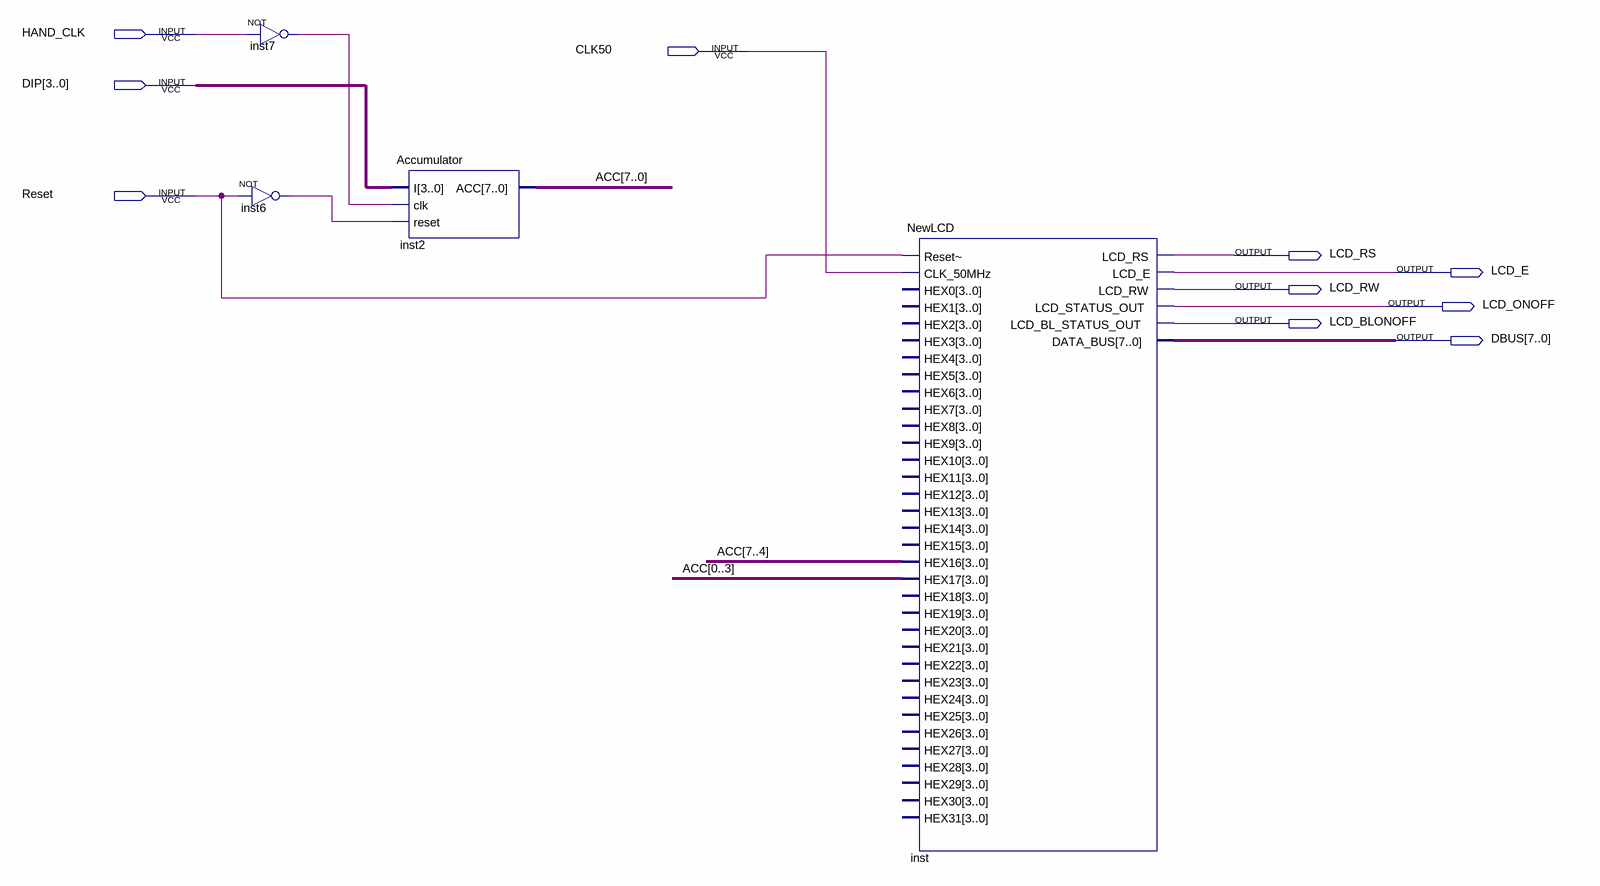
[diagram p0: schematic sheet]
// Quartus schematic AccBoard.bdf as structural Verilog: 4 symbols, 10 pins
module AccBoard (
  input  HAND_CLK,
  input  CLK50,
  input  [3:0] DIP,
  input  Reset,
  output LCD_RS,
  output LCD_E,
  output LCD_RW,
  output LCD_ONOFF,
  output LCD_BLONOFF,
  output [7:0] DBUS
);

  wire inst6_out, inst7_out;
  wire [7:0] ACC;

  not inst7 (inst7_out, HAND_CLK);
  not inst6 (inst6_out, Reset);
  Accumulator inst2 (.I(DIP), .clk(inst7_out), .reset(inst6_out), .ACC(ACC));
  NewLCD inst (
    .\Reset~ (Reset), .CLK_50MHz(CLK50), .HEX16(ACC[7:4]), .HEX17({ACC[0], ACC[1], ACC[2], ACC[3]}),
    .LCD_RS(LCD_RS), .LCD_E(LCD_E), .LCD_RW(LCD_RW), .LCD_STATUS_OUT(LCD_ONOFF),
    .LCD_BL_STATUS_OUT(LCD_BLONOFF), .DATA_BUS(DBUS));  // open: HEX0, HEX1, HEX2, HEX3, HEX4, HEX5, HEX6, HEX7, HEX8, HEX9, HEX10, HEX11, HEX12, HEX13, HEX14, HEX15, HEX18, HEX19, HEX20, HEX21, HEX22, HEX23, HEX24, HEX25, HEX26, HEX27, HEX28, HEX29, HEX30, HEX31
endmodule
